# Altium schematic sheet PDMTest.SchDoc
size A4
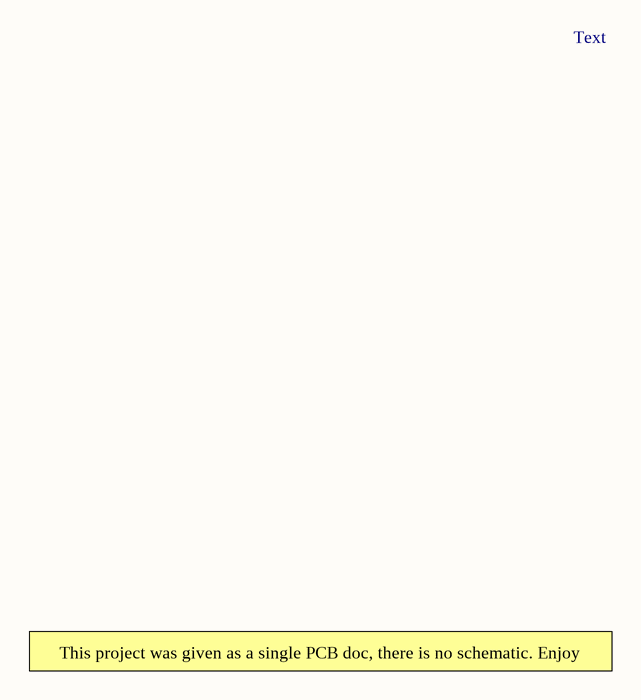
[diagram p0: PDMTest.SchDoc]

## Notes on the sheet
- Text
- This project was given as a single PCB doc, there is no schematic. Enjoy